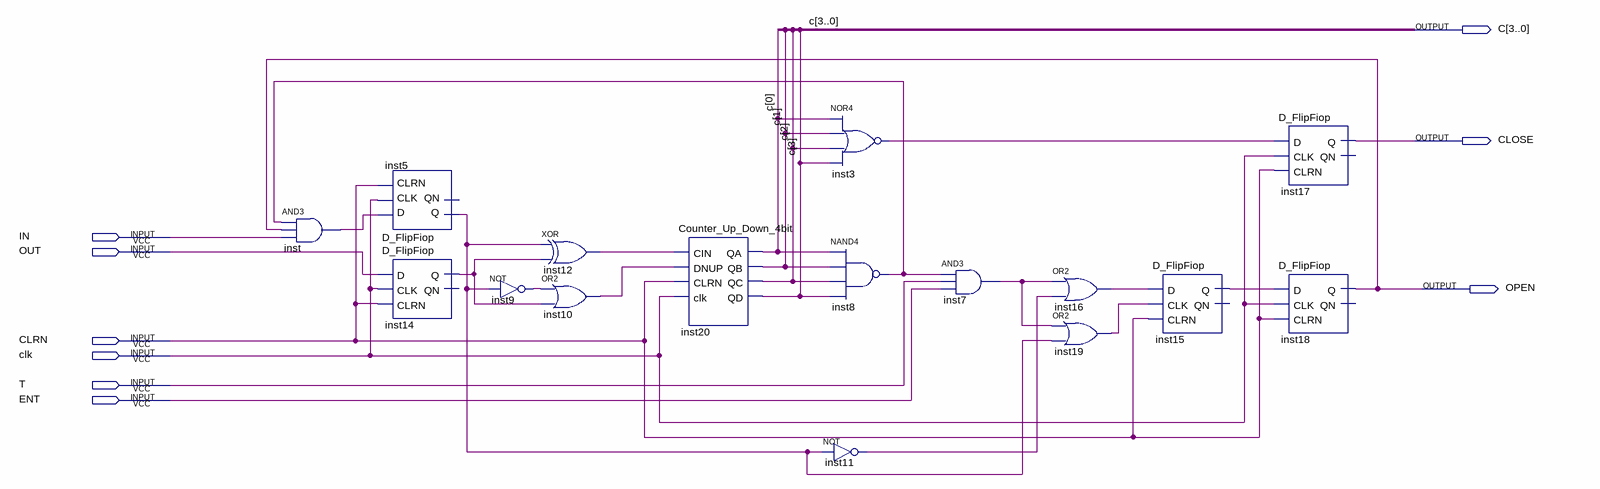
[diagram p0: schematic sheet]
// Quartus schematic Main.bdf as structural Verilog: 16 symbols, 9 pins
module Main (
  input  IN,
  input  OUT,
  input  CLRN,
  input  clk,
  input  T,
  input  ENT,
  output [3:0] C,
  output CLOSE,
  output OPEN
);

  wire inst3_out, inst5_q, inst7_out, inst8_out, inst9_out, inst10_out, inst11_out, inst12_out, inst14_q,
       inst15_q, inst16_out, inst19_out, inst_out;

  and inst (inst_out, inst8_out, OPEN, IN);
  D_FlipFiop inst5 (.D(inst_out), .CLK(clk), .CLRN(CLRN), .Q(inst5_q));  // open: QN
  D_FlipFiop inst14 (.D(OUT), .CLK(clk), .CLRN(CLRN), .Q(inst14_q));  // open: QN
  not inst9 (inst9_out, inst5_q);
  xor inst12 (inst12_out, inst5_q, inst14_q);
  or inst10 (inst10_out, inst9_out, inst14_q);
  Counter_Up_Down_4bit inst20 (
    .CIN(inst12_out), .DNUP(inst10_out), .CLRN(CLRN), .clk(clk), .QA(C[0]), .QB(C[1]), .QC(C[2]), .QD(C[3]));
  nor inst3 (inst3_out, C[0], C[1], C[2], C[3]);
  nand inst8 (inst8_out, C[0], C[1], C[2], C[3]);
  not inst11 (inst11_out, inst5_q);
  and inst7 (inst7_out, inst8_out, T, ENT);
  or inst16 (inst16_out, inst7_out, inst11_out);
  or inst19 (inst19_out, inst7_out, inst5_q);
  D_FlipFiop inst15 (.D(inst16_out), .CLK(inst19_out), .CLRN(CLRN), .Q(inst15_q));  // open: QN
  D_FlipFiop inst17 (.D(inst3_out), .CLK(clk), .CLRN(CLRN), .Q(CLOSE));  // open: QN
  D_FlipFiop inst18 (.D(inst15_q), .CLK(clk), .CLRN(CLRN), .Q(OPEN));  // open: QN
endmodule
